# EAGLE design CAMCTRL_USB_328_3DR_CNCT_4LAY_V6 (EAGLE 6.5.0)
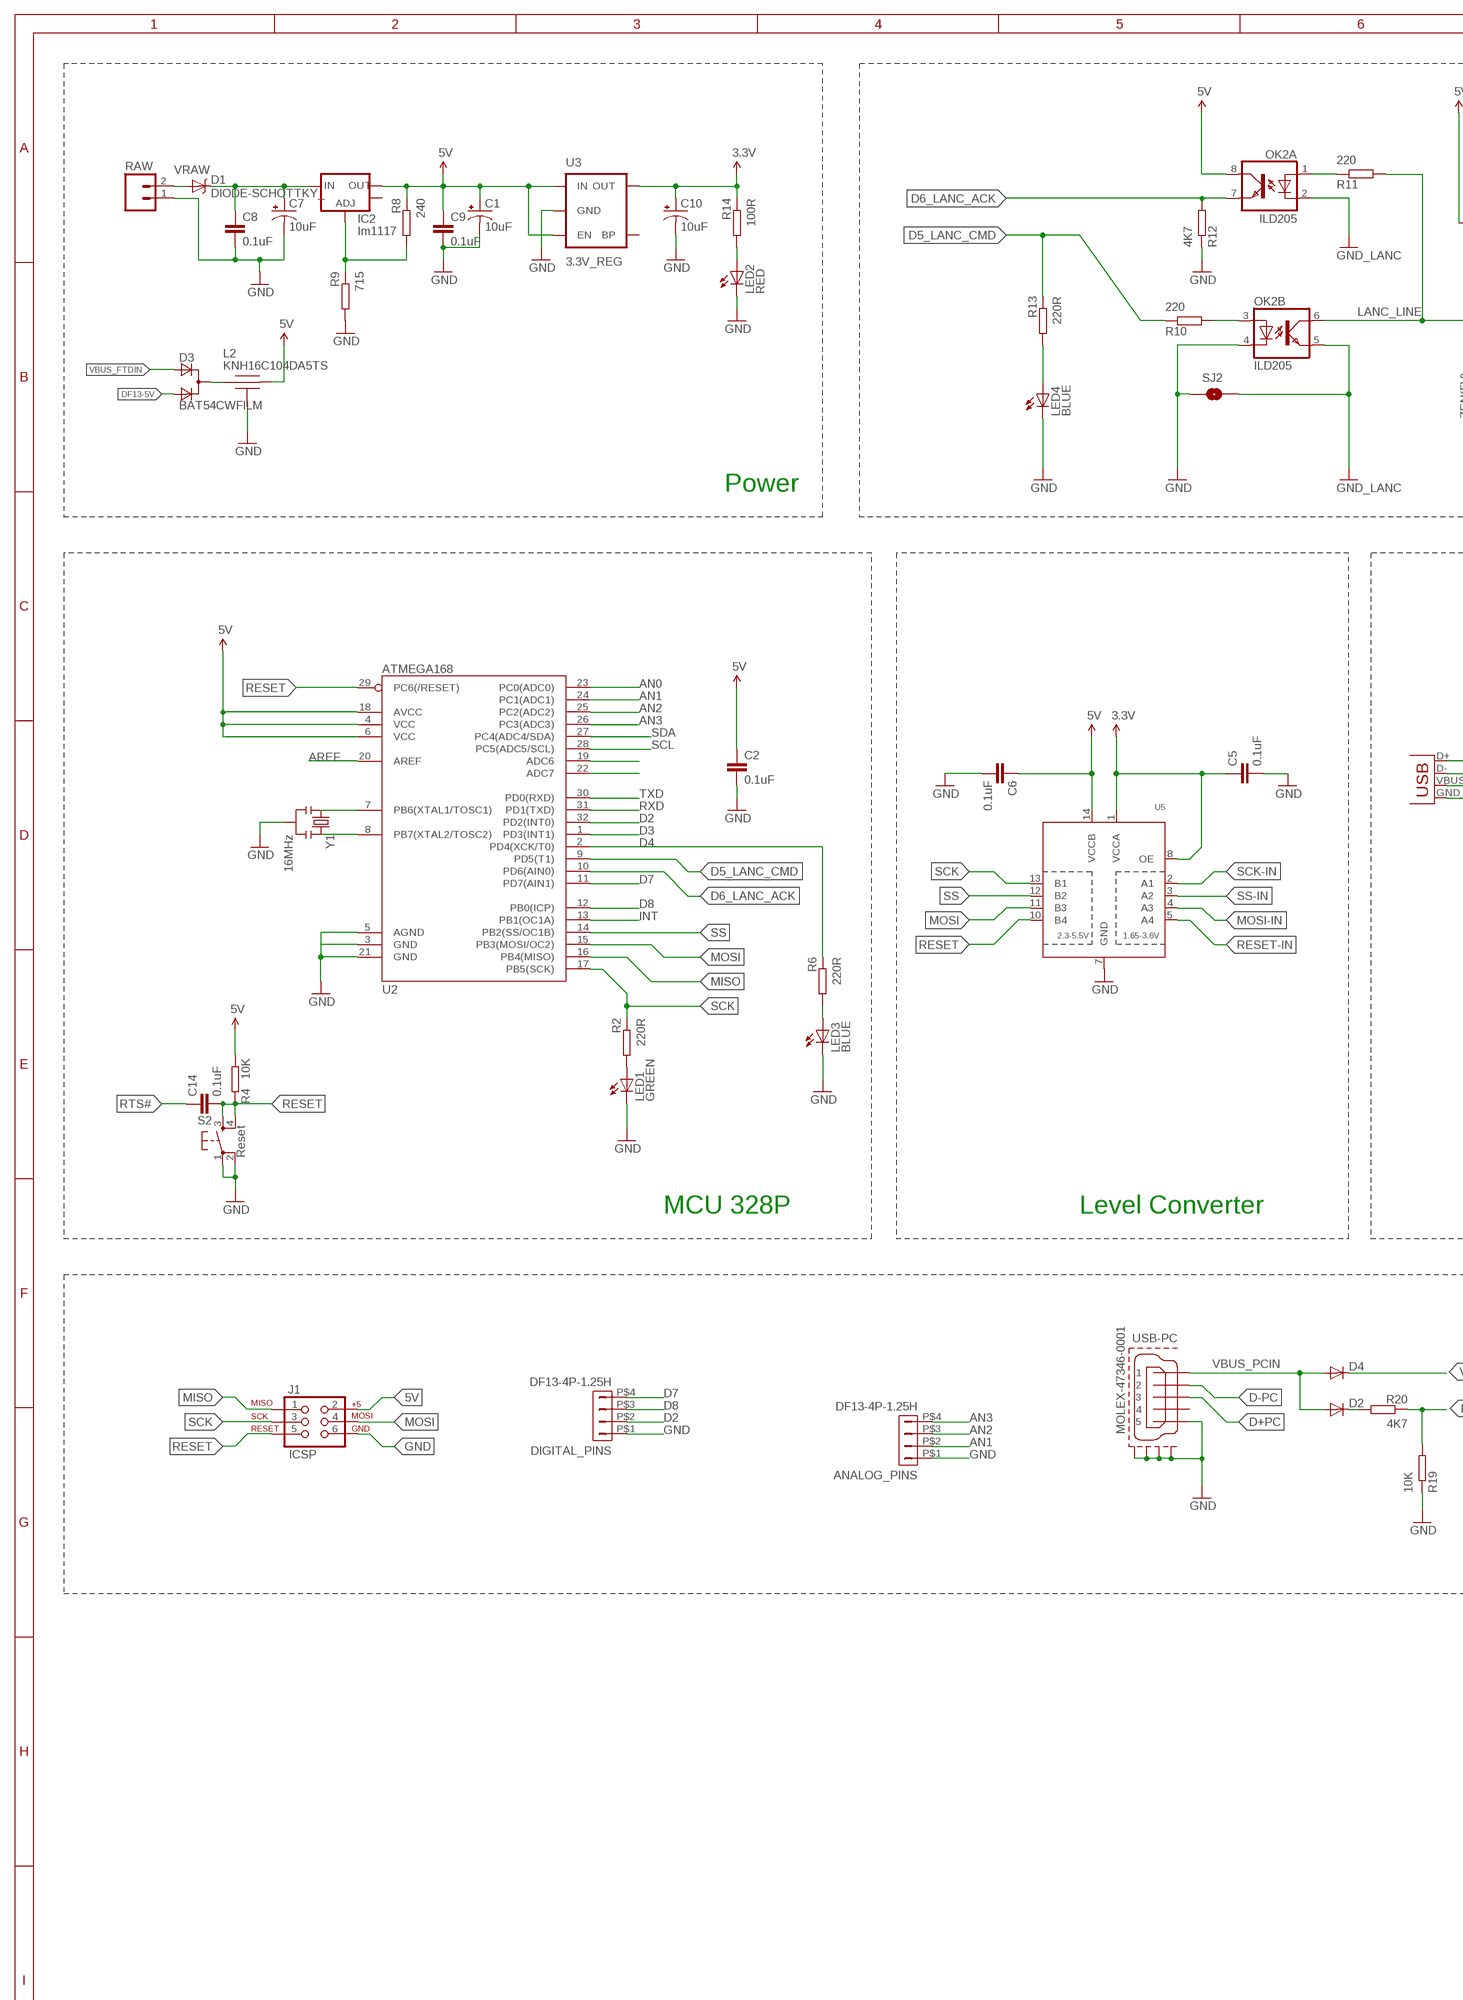
[diagram p0: schematic, sheet 1, part 1 of 2]
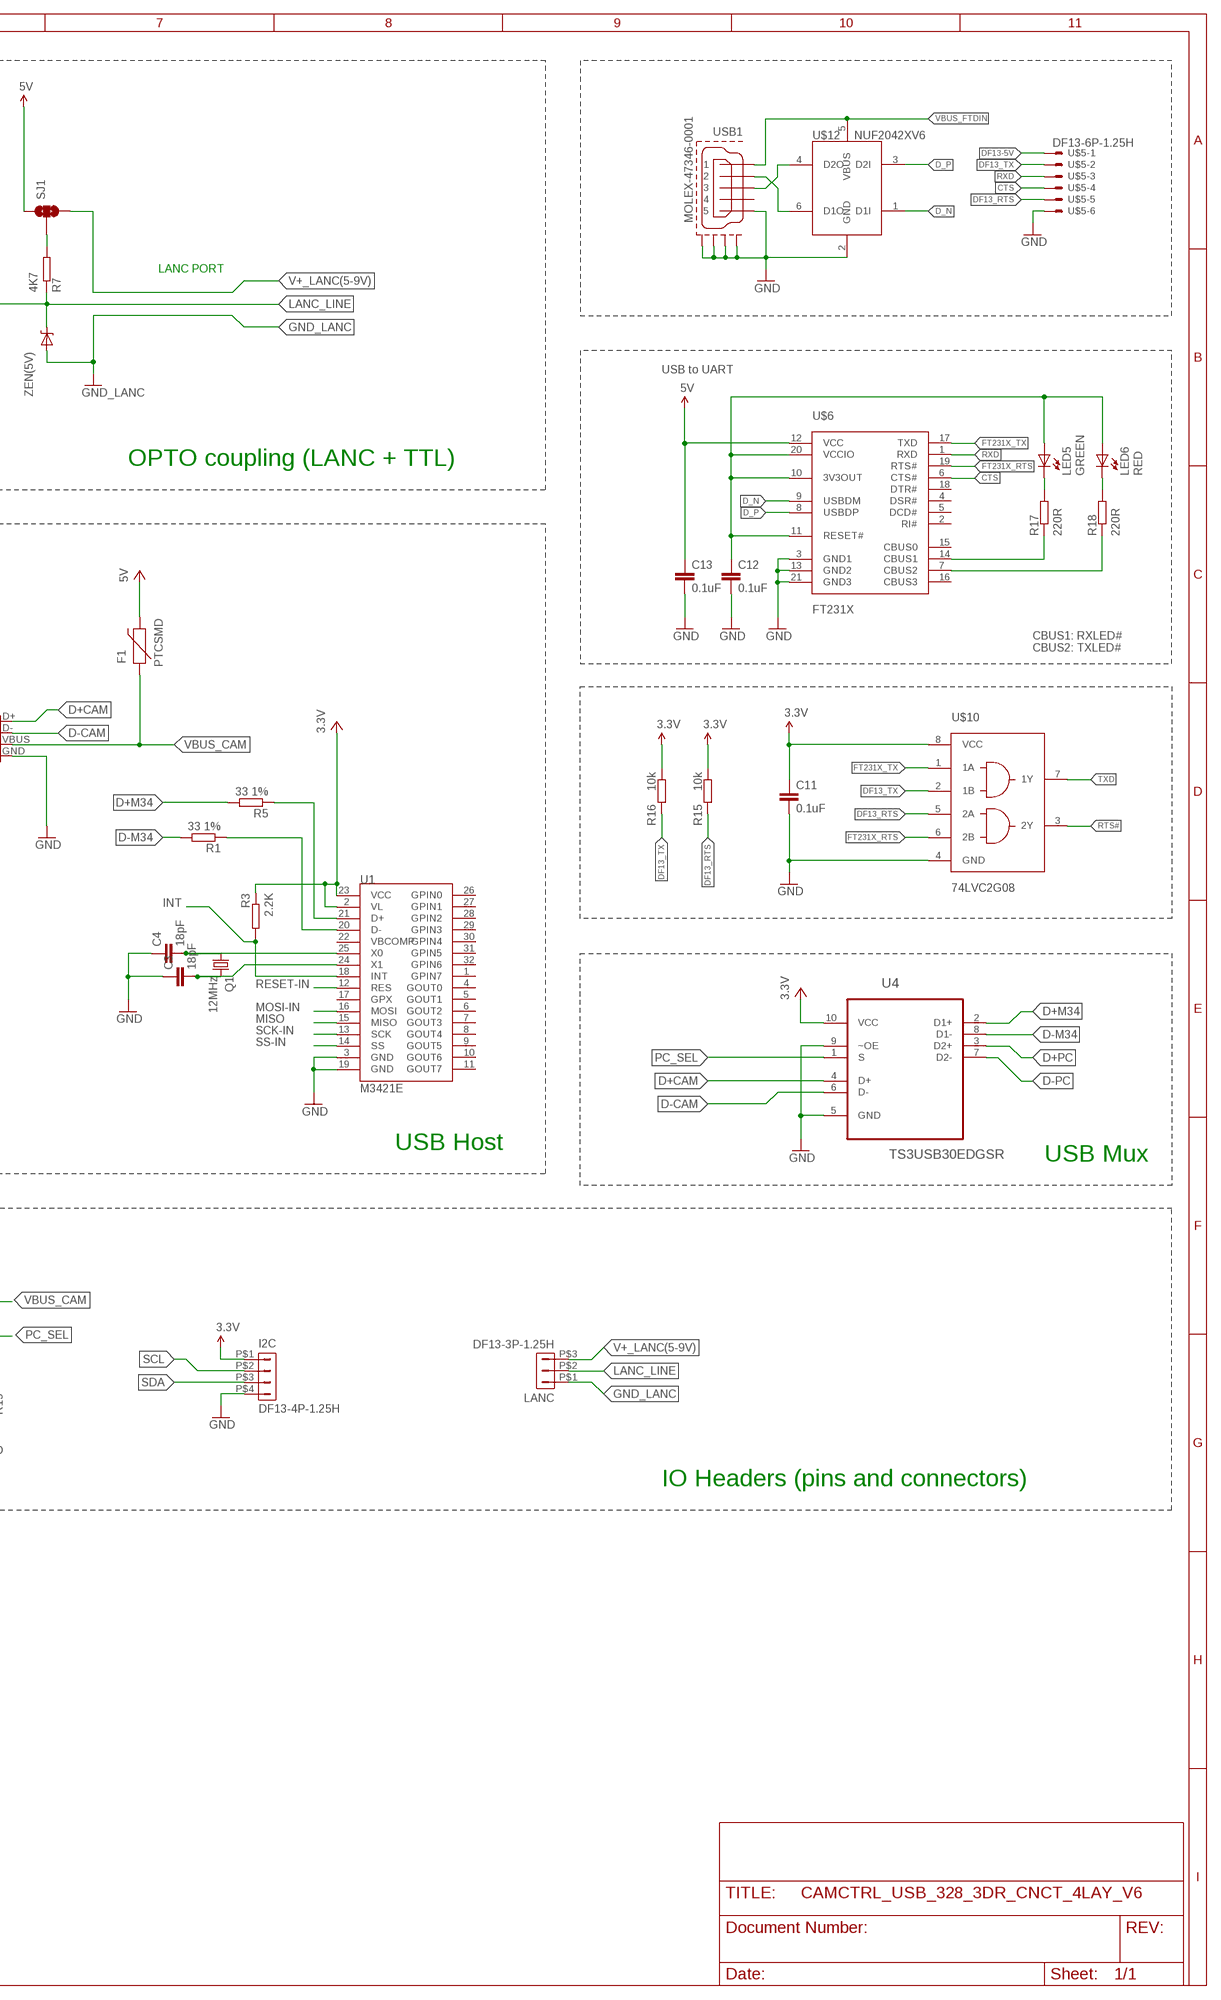
[diagram p1: schematic, sheet 1, part 2 of 2]

## Parts
ANALOG_PINS  DF13-4P-1.25H  [DF13A-4P-1.25H]
C1  10uF  CAP_POL1206  [EIA3216]
C2  0.1uF  CAPACITOR-0402  [0402-CAP]
C3  18pF  CAPACITOR-0402  [0402-CAP]
C4  18pF  CAPACITOR-0402  [0402-CAP]
C5  0.1uF  CAPACITOR-0402  [0402-CAP]
C6  0.1uF  CAPACITOR-0402  [0402-CAP]
C7  10uF  CAP_POL1206  [EIA3216]
C8  0.1uF  CAPACITOR-0402  [0402-CAP]
C9  0.1uF  CAPACITOR-0402  [0402-CAP]
C10  10uF  CAP_POL1206  [EIA3216]
C11  0.1uF  CAPACITOR-0402  [0402-CAP]
C12  0.1uF  CAPACITOR-0402  [0402-CAP]
C13  0.1uF  CAPACITOR-0402  [0402-CAP]
C14  0.1uF  CAPACITOR-0402  [0402-CAP]
D1  DIODE-SCHOTTKY_  [SMA-DIODE]
D2  DIODE-0603  [0603-DIO]
D3  BAT54CWFILM  D_2ASOT323  [SOT323]
D4  DIODE-0603  [0603-DIO]
DIGITAL_PINS  DF13-4P-1.25H  [DF13A-4P-1.25H]
F1  PTCSMD  [PTC-1206]
I2C  DF13-4P-1.25H  [DF13A-4P-1.25H]
IC2  lm1117  V_REG_LM1117SOT223  [SOT223]
J1  ICSP  AVR_SPI_PRG_6PTH  [2X3]
L2  KNH16C104DA5TS  [KYOCERA-KNH16-DA]
LANC  DF13-3P-1.25H  [DF13A-3P-1.25H]
LED1  GREEN  LED-0603  [0603-LED]
LED2  RED  LED-0603  [0603-LED]
LED3  BLUE  LED-0603  [0603-LED]
LED4  BLUE  LED-0603  [0603-LED]
LED5  GREEN  LED-0603  [0603-LED]
LED6  RED  LED-0603  [0603-LED]
OK2  ILD205  [SOIC08]
Q1  12MHz  CRYSTAL5X3  [CRYSTAL-SMD-5X3]
R1  33 1%  RESISTOR-0402  [0402-RES]
R2  220R  RESISTOR-0402  [0402-RES]
R3  2.2K  RESISTOR-0402  [0402-RES]
R4  10K  RESISTOR-0402  [0402-RES]
R5  33 1%  RESISTOR-0402  [0402-RES]
R6  220R  RESISTOR-0402  [0402-RES]
R7  4K7  RESISTOR-0402  [0402-RES]
R8  240  RESISTOR-0402  [0402-RES]
R9  715  RESISTOR-0402  [0402-RES]
R10  220  RESISTOR-0402  [0402-RES]
R11  220  RESISTOR-0402  [0402-RES]
R12  4K7  RESISTOR-0402  [0402-RES]
R13  220R  RESISTOR-0402  [0402-RES]
R14  100R  RESISTOR-0402  [0402-RES]
R15  10k  RESISTOR-0402  [0402-RES]
R16  10k  RESISTOR-0402  [0402-RES]
R17  220R  RESISTOR-0402  [0402-RES]
R18  220R  RESISTOR-0402  [0402-RES]
R19  10K  RESISTOR-0402  [0402-RES]
R20  4K7  RESISTOR-0402  [0402-RES]
RAW  M02PTH  [1X02]
S2  Reset  TAC_SWITCHSND  [TACTILE_SWITCH_SMD]
SJ1  SOLDERJUMPER_2WAYPASTE2&3  [SJ_3_PASTE2&3]
SJ2  SOLDERJUMPER-OLDNO  [SJ_2S-NO]
U1  M3421E  MAX3421ESMD  [TQFP32-5MM]
U2  ATMEGA168  [TQFP32-08]
U3  3.3V_REG  V_REG_LDOSMD  [SOT23-5]
U4  TS3USB30EDGSR  [SOP50P490X110-10N]
U5  TXS0104PWR  [TSSOP14]
U$5  DF13-6P-1.25H  [DF13A-6P-1.25H]
U$6  FT231X  [QFN20]
U$10  74LVC2G08  [VFSOP-8]
U$12  NUF2042XV6  [SOT563-6]
USB1  MOLEX-47346-0001  [MOLEX-47346-0001]
USB-PC  MOLEX-47346-0001  [MOLEX-47346-0001]
USB_HOST  USB-A-SMD  [USB-A-S-NOSILK-FEMALE]
Y1  16MHz  RESONATOR16MHZ  [RESONATOR-SMD]
ZEN(5V)  (5V)  DIODE-ZENER-0603  [0603-DIO]

## Nets
3.3V: C5.P$1 C10.A(+) C11.P$1 I2C.P$1 R3.P$1 R14.P$1 R15.P$1 R16.P$1 U1.2(VL) U1.23(VCC) U3.5(OUT) U4.10(VCC) U5.1(VCCA) U5.8(OE) U$10.8(VCC)
5V: C1.A(+) C2.P$1 C6.P$1 C9.P$1 C13.P$1 F1.2 IC2.2(OUT) J1.2 L2.P$2 OK2.8(A:COL) R4.P$2 R8.P$1 SJ1.1 U2.4(VCC) U2.6(VCC) U2.18(AVCC) U3.1(IN) U3.3(EN) U5.14(VCCB) U$6.12(VCC)
AN0: U2.23(PC0(ADC0))
AN1: ANALOG_PINS.P$2 U2.24(PC1(ADC1))
AN2: ANALOG_PINS.P$3 U2.25(PC2(ADC2))
AN3: ANALOG_PINS.P$4 U2.26(PC3(ADC3))
AREF: U2.20(AREF)
CTS: U$5.4 U$6.6(CTS#)
D2: DIGITAL_PINS.P$2 U2.32(PD2(INT0))
D3: U2.1(PD3(INT1))
D4: R6.P$1 U2.2(PD4(XCK/T0))
D5_LANC_CMD: R10.P$1 R13.P$1 U2.9(PD5(T1))
D6_LANC_ACK: OK2.7(A:EMIT) R12.P$2 U2.10(PD6(AIN0))
D7: DIGITAL_PINS.P$4 U2.11(PD7(AIN1))
D8: DIGITAL_PINS.P$3 U2.12(PB0(ICP))
D+CAM: U4.4(D+) USB_HOST.D+
D+M34: R5.P$2 U4.2(D1+)
D+PC: U4.3(D2+) USB-PC.D+
D-CAM: U4.6(D-) USB_HOST.D-
D-M34: R1.P$2 U4.8(D1-)
D-PC: U4.7(D2-) USB-PC.D-
D_N: U$6.9(USBDM) U$12.1(D1I)
D_P: U$6.8(USBDP) U$12.3(D2I)
DF13-5V: D3.3(A2) U$5.1
DF13_RTS: R15.P$2 U$5.5 U$10.5(2A)
DF13_TX: R16.P$2 U$5.2 U$10.2(1B)
FT231X_RTS: U$6.19(RTS#) U$10.6(2B)
FT231X_TX: U$6.17(TXD) U$10.1(1A)
GND: ANALOG_PINS.P$1 C1.C(-) C2.P$2 C3.P$1 C4.P$1 C5.P$2 C6.P$2 C7.C(-) C8.P$2 C9.P$2 C10.C(-) C11.P$2 C12.P$2 C13.P$2 DIGITAL_PINS.P$1 I2C.P$4 J1.6 L2.P$3 L2.P$4 L2.P$5 LED1.C LED2.C LED3.C LED4.C OK2.4(B:C) R9.P$2 R12.P$1 R19.P$1 RAW.1 S2.1 S2.2 SJ2.1 U1.3(GND) U1.19(GND) U2.3(GND) U2.5(AGND) U2.21(GND) U3.2(GND) U4.5(GND) U4.9(~OE) U5.7(GND) U$5.6 U$6.3(GND1) U$6.13(GND2) U$6.21(GND3) U$10.4(GND) U$12.2(GND) USB1.GND USB1.GND1 USB1.GND2 USB1.GND3 USB1.GND4 USB-PC.GND USB-PC.GND1 USB-PC.GND2 USB-PC.GND3 USB-PC.GND4 USB_HOST.GND Y1.2
GND_LANC: LANC.P$1 OK2.2(A:C) OK2.5(B:EMIT) SJ2.2 ZEN(5V).A ; supply symbol labelled GND
INT: R3.P$2 U1.18(INT) U2.13(PB1(OC1A))
LANC_LINE: LANC.P$2 OK2.6(B:COL) R7.P$1 R11.P$2 ZEN(5V).C
MISO: J1.1 U1.15(MISO) U2.16(PB4(MISO))
MOSI: J1.4 U2.15(PB3(MOSI/OC2)) U5.11(B3)
MOSI-IN: U1.16(MOSI) U5.4(A3)
N$1: OK2.3(B:A) R10.P$2
N$2: U2.7(PB6(XTAL1/TOSC1)) Y1.1
N$3: U2.8(PB7(XTAL2/TOSC2)) Y1.3
N$4: LED1.A R2.P$2
N$5: C4.P$2 Q1.1 U1.25(X0)
N$6: R5.P$1 U1.21(D+)
N$7: R1.P$1 U1.20(D-)
N$8: C3.P$2 Q1.3 U1.24(X1)
N$9: IC2.1(ADJ) R8.P$2 R9.P$1
N$10: OK2.1(A:A) R11.P$1
N$12: LED3.A R6.P$2
N$13: R7.P$2 SJ1.2
N$14: D3.1(C) L2.P$1
N$15: LED4.A R13.P$2
N$16: U2.19(ADC6)
N$17: U2.22(ADC7)
N$19: U$12.6(D1O) USB1.D-
N$20: U$12.4(D2O) USB1.D+
N$21: C12.P$1 LED5.A LED6.A U$6.10(3V3OUT) U$6.11(RESET#) U$6.20(VCCIO)
N$22: R17.P$1 U$6.14(CBUS1)
N$23: R18.P$1 U$6.7(CBUS2)
N$24: LED5.C R17.P$2
N$25: LED2.A R14.P$2
N$26: LED6.C R18.P$2
N$27: D1.A RAW.2
N$28: D2.C R20.P$2
PC_SEL: R19.P$2 R20.P$1 U4.1(S)
RESET: C14.P$2 J1.5 R4.P$1 S2.3 S2.4 U2.29(PC6(/RESET)) U5.10(B4)
RESET-IN: U1.12(RES) U5.5(A4)
RTS#: C14.P$1 U$10.3(2Y)
RXD: U2.31(PD1(TXD)) U$5.3 U$6.1(RXD)
SCK: J1.3 R2.P$1 U2.17(PB5(SCK)) U5.13(B1)
SCK-IN: U1.13(SCK) U5.2(A1)
SCL: I2C.P$2 U2.28(PC5(ADC5/SCL))
SDA: I2C.P$3 U2.27(PC4(ADC4/SDA))
SS: U2.14(PB2(SS/OC1B)) U5.12(B2)
SS-IN: U1.14(SS) U5.3(A2)
TXD: U2.30(PD0(RXD)) U$10.7(1Y)
V+_LANC(5-9V): LANC.P$3 SJ1.3
VBUS_CAM: D4.C F1.1 USB_HOST.VBUS
VBUS_FTDIN: D3.2(A1) U$12.5(VBUS) USB1.VBUS
VBUS_PCIN: D2.A D4.A USB-PC.VBUS
VRAW: C7.A(+) C8.P$1 D1.C IC2.3(IN)
Unconnected: IC2.4(OUT) U1.1(GPIN7) U1.4(GOUT0) U1.5(GOUT1) U1.6(GOUT2) U1.7(GOUT3) U1.8(GOUT4) U1.9(GOUT5) U1.10(GOUT6) U1.11(GOUT7) U1.17(GPX) U1.22(VBCOMP) U1.26(GPIN0) U1.27(GPIN1) U1.28(GPIN2) U1.29(GPIN3) U1.30(GPIN4) U1.31(GPIN5) U1.32(GPIN6) U3.4(BP) U$6.2(RI#) U$6.4(DSR#) U$6.5(DCD#) U$6.15(CBUS0) U$6.16(CBUS3) U$6.18(DTR#) USB1.ID USB-PC.ID

## Notes on the sheet
- LANC PORT
- USB to UART
- Power | OPTO coupling (LANC + TTL)
- CBUS1: RXLED#
  CBUS2: TXLED#
- MCU 328P | Level Converter | USB Host
- USB Mux
- IO Headers (pins and connectors)

## Library data of the parts
ANALOG_PINS DIGITAL_PINS I2C = con-hirose-df13:DF13-4P-1.25: DF13-4P 1.25mm Pitch Miniature Crimping Connector.
C1 C7 C10 = SparkFun:CAP_POL: Capacitor Polarized These are standard SMD and PTH capacitors. Normally 10uF, 47uF, and 100uF in electrolytic and tantalum varieties. Always verify the external diameter of the through hole cap, it varies with capacity, voltage, and manufacturer. The EIA devices should be standard.
C2-C6 C8 C9 C11-C14 = pel_dipol_comp:CAPACITOR
D1 = SparkFun-DiscreteSemi:DIODE-SCHOTTKY: Commonly MBRA140.
D2 D4 = pel_dipol_comp:DIODE
D3 = zetex:D_2A: Dual DIODE; OC_FARNELL: unknown; OC_NEWARK: unknown
F1 = SparkFun:PTC: Resettable Fuse PTC Resettable Fuse. Spark Fun Electronics SKU : COM-08357
IC2 = SparkFun:V_REG_LM1117: Voltage Regulator LM1117 Standard adjustable voltage regulator but in SMD form. Spark Fun Electronics SKU : COM-00595
J1 = SparkFun-Connectors:AVR_SPI_PRG_6: AVR ISP 6 Pin This is the reduced ISP connector for AVR programming. Common on Arduino. This footprint will take up less PCB space and can be used with a 10-pin to 6-pin adapter such as SKU: BOB-08508
L2 = pixhawk2:KNH16C104DA5TS: Kyocera KNH16C104DA5TS EMI filter
LANC = con-hirose-df13:DF13-3P-1.25: DF13-3P 1.25mm Pitch Miniature Crimping Connector.
LED1-LED6 = pel_dipol_comp:LED
OK2 = optocoupler:ILD2*: Siemens ILD205/206/207/211/213/217 DUAL PHOTOTRANSISTOR SMALL OUTLINE SURFACE MOUNT OPTOCOUPLER Source: 153385-da-01-en-Optocoupler_ILD205-T.pdf; MF: VISHAY/TELEFUNKEN; MPN: ILD205T; OC_FARNELL: 1469512; OC_NEWARK: 20H8678
Q1 = SparkFun-FreqCtrl:CRYSTAL: Various standard crystals. Proven footprints. Spark Fun Electronics SKU : COM-00534
R1-R20 = pel_dipol_comp:RESISTOR
RAW = SparkFun-Connectors:M02: Header 2 Standard 2-pin 0.1" header. Use with straight break away headers (SKU : PRT-00116), right angle break away headers (PRT-00553), swiss pins (PRT-00743), machine pins (PRT-00117), and female headers (PRT-00115). Molex polarized connector foot print use with SKU : PRT-08233 with associated crimp pins and housings.
S2 = SparkFun:TAC_SWITCH: Momentary Switch Button commonly used for reset or general input. Spark Fun Electronics SKU : COM-00097
SJ1 = SparkFun-Passives:SOLDERJUMPER_2WAY: Solder Jumper 2 way solder jumper
SJ2 = SparkFun-Passives:SOLDERJUMPER-OLD: Solder Jumper Standard SMD solder jumper. Used to automate production. Two varients : Normally Open and Normally Closed are the same, but have different paste layers. NC will have a large amount of paste and should jumper during reflow.
U1 = SparkFun-DigitalIC:MAX3421E: USB Peripheral/Host Controller w/ SPI
U2 = SparkFun-DigitalIC:ATMEGA168: Atmel 32-pin 8-bit micro, 16k flash.
U3 = SparkFun:V_REG_LDO: Voltage Regulator LDO Standard 150mA LDO voltage regulator in SOT-23 layout. Micrel part MIC5205. BP (by-pass) pin is used to lower output noise with 470pF cap.
U4 = Texas Instruments_By_element14_Batch_1:TS3USB30EDGSR: 1:2 MULTIPLEXER/DEMULTIPLEXER; MPN: TS3USB30EDGSR; OC_FARNELL: -; OC_NEWARK: 64R0806; PACKAGE: MSOP-10; SUPPLIER: Texas Instruments
U5 = adafruit:TXS0104PWR: 4-Bit Bi-Directional Level Shifter 1.65V-3.6V (VCCA) to 2.3V-5.5V (VCCB) bi-directional level shifter with auto direction sensing. Max data rate - VCCA 2.5V: 24Mbps (41ns), VCCA 3.3V: 24Mbps (41ns) Digikey: 296-20697-2-ND
U$5 = pixhawk2:DF13-6P-1.25?
U$6 = 3DRobotics:FT231X: FT231X – Full Speed USB to Full Handshake UART This USB2.0 Full Speed IC offers a compact bridge to full handshake UART interfaces. The device is a UART, capable of operating up to 3MBaud, with low power consumption (8mA). The FT231X includes the complete FT-X series feature set and enables USB to be added into a system design quickly and easily over a UART interface; DATASHEET: http://www.ftdichip.com/Support/Documents/DataSheets/ICs/DS_FT231X.pdf; LINK: http://www.ftdichip.com/Products/ICs/FT231X.html; MFGPN: FT231X
U$10 = 3DRobotics:74LVC2G08: 74LVC2G08 dual 2-input AND gate Inputs can be driven from either 3.3 V or 5 V devices. This feature allows the use of the 74LVC2G08 as a translator in a mixed 3.3 V and 5 V environment. This device is fully specified for partial power-down applications using IOFF. The IOFF circuitry disables the output, preventing a damaging backflow current through the device when it is powered down.; DATASHEET: http://www.nxp.com/documents/data_sheet/74LVC2G08.pdf; LINK: http://www.nxp.com/products/logic/gates/and_gates/74LVC2G08DC.html; MFGPN: 74LVC2G08
U$12 = pixhawk2:NUF2042XV6
USB1 USB-PC = pixhawk2:MOLEX-47346-0001: MICRO USB B, BOTTOM MOUNT
USB_HOST = SparkFun-Connectors:USB: USB Connectors USB-B-PTH is fully proven SKU : PRT-00139/CONN-08278 USB-miniB is fully proven SKU : PRT-00587 USB-A-PCB is untested. USB-A-H is throughly reviewed, but untested. Spark Fun Electronics SKU : PRT-00437 USB-B-SMT is throughly reviewed, but untested. Needs silkscreen touching up. USB-A-S has not been used/tested USB-MB-H has not been used/tested USB-MICROB has been used. CONN-09505; PROD_ID: CONN-09520
Y1 = SparkFun-FreqCtrl:RESONATOR: Resonator Small SMD resonator. Used, eg, on the Arduino Pro/ Pro Mini boards. 8MHz- XTAL-08895 16MHz- XTAL-08900; PROD_ID: XTAL-08900
ZEN(5V) = pel_dipol_comp:DIODE-ZENER

## Net classes
0 default: width 0.152 mm

## Board
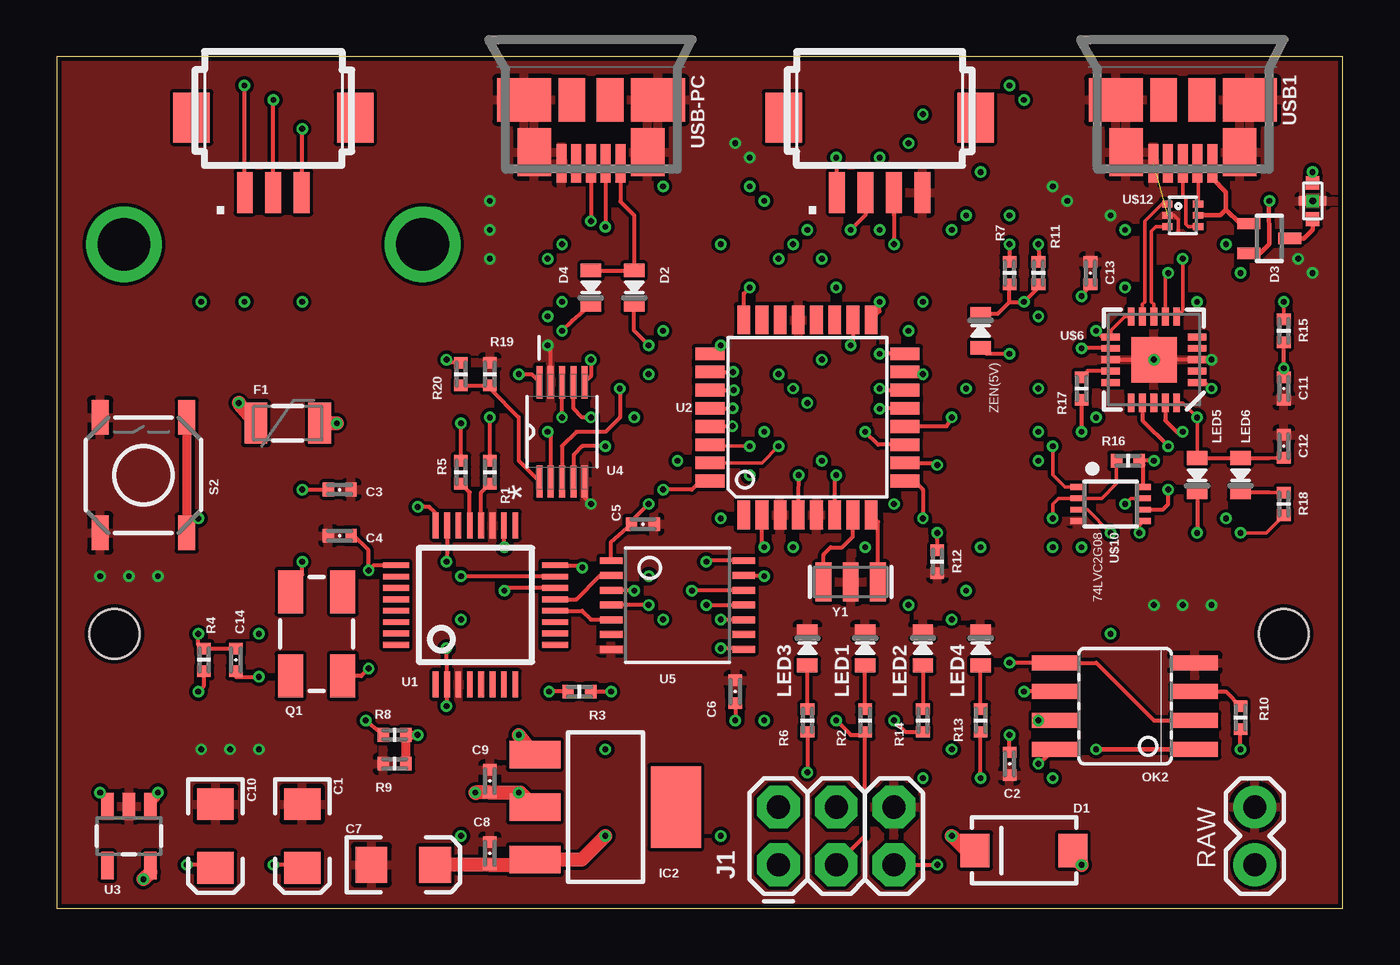
[diagram p2: board, top side]
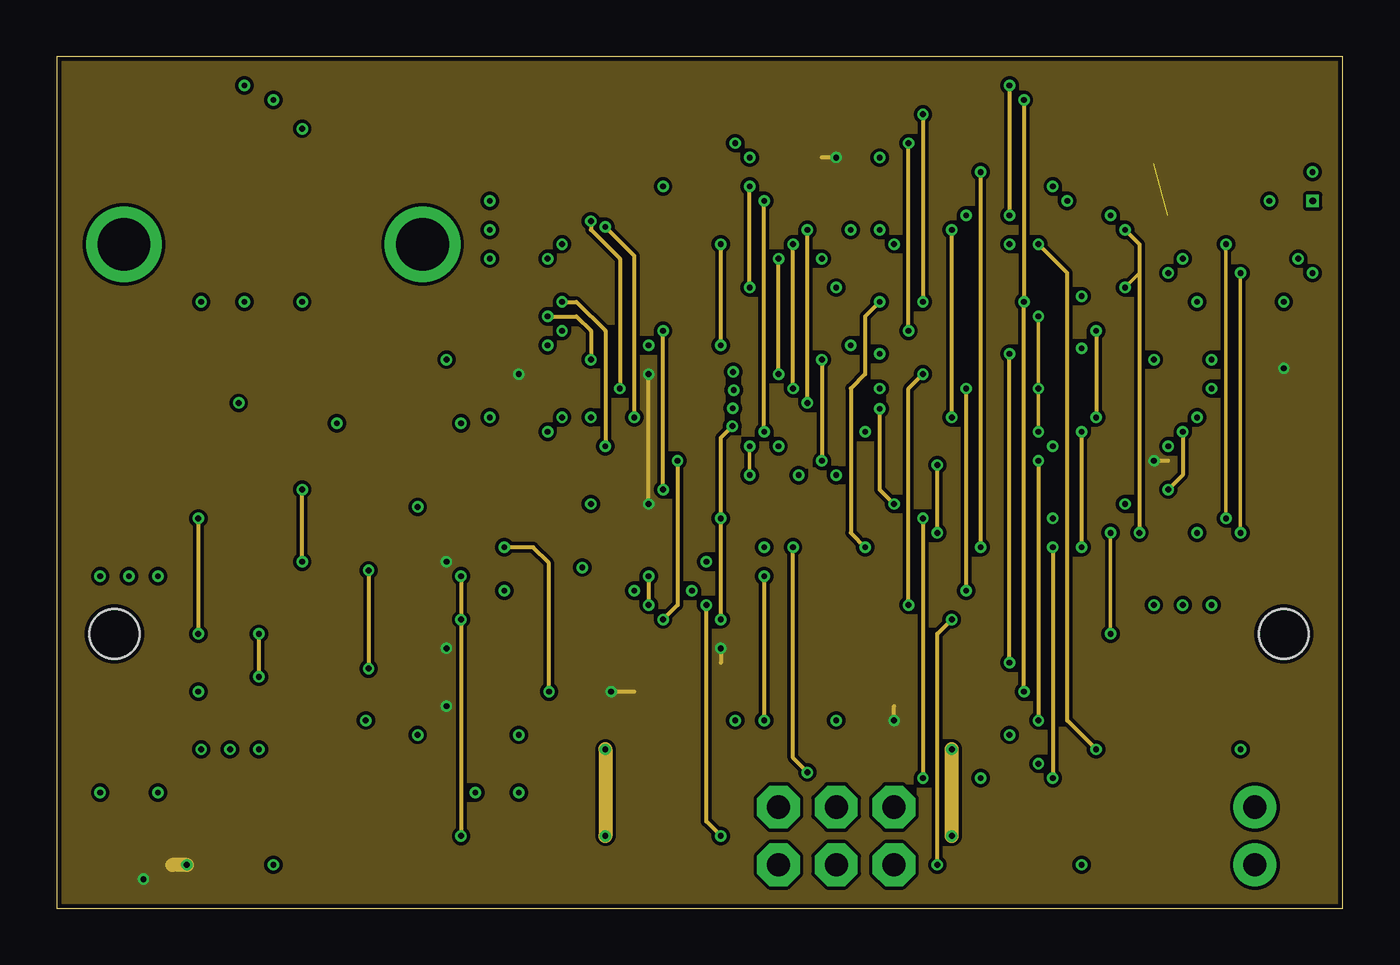
[diagram p3: board, inner layer Route2]
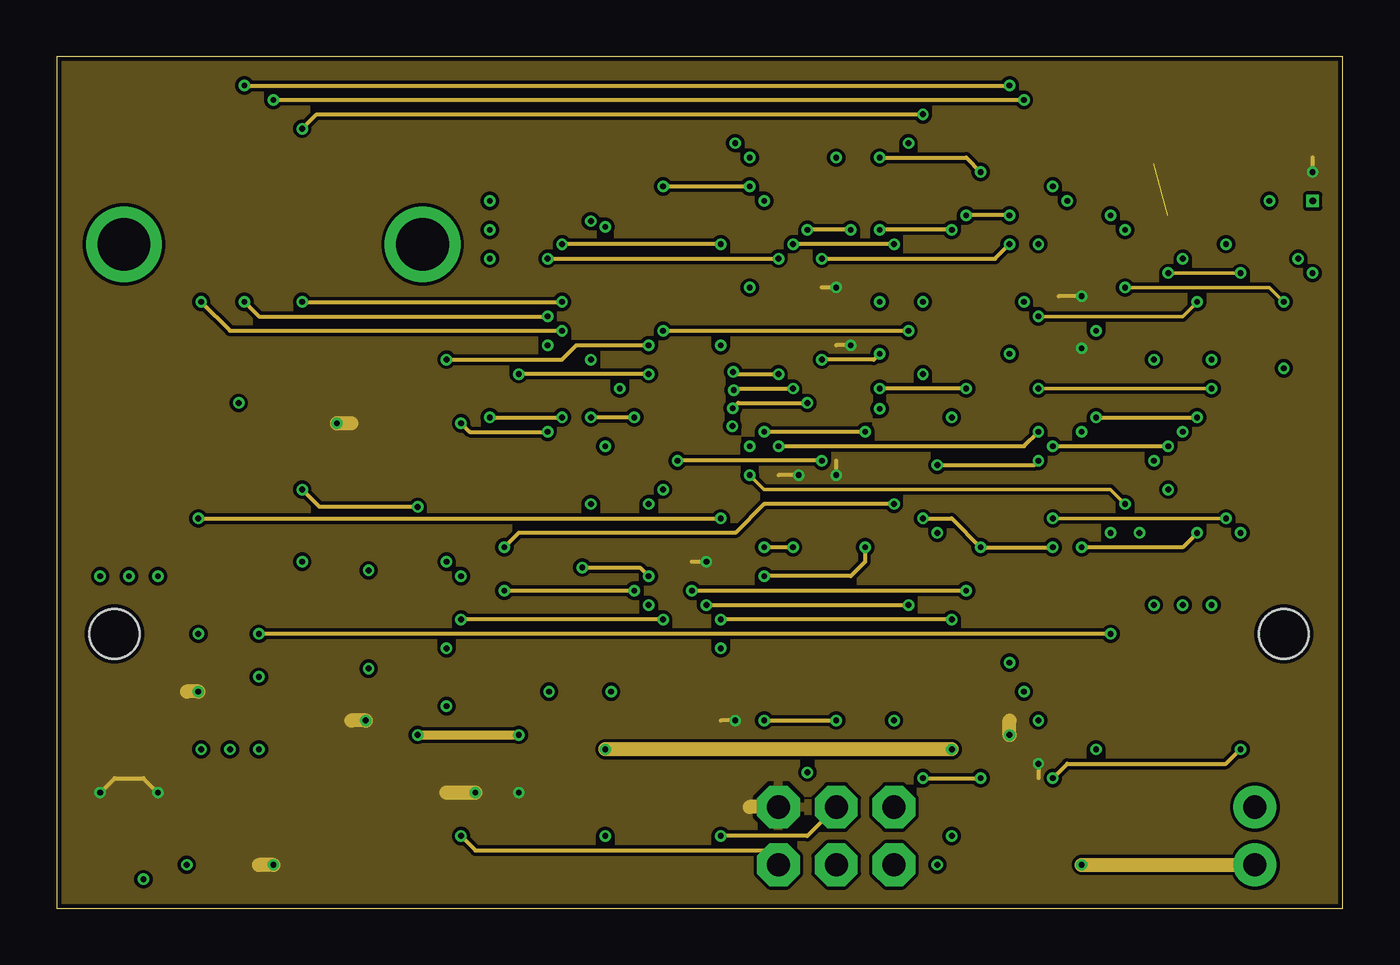
[diagram p4: board, inner layer Route15]
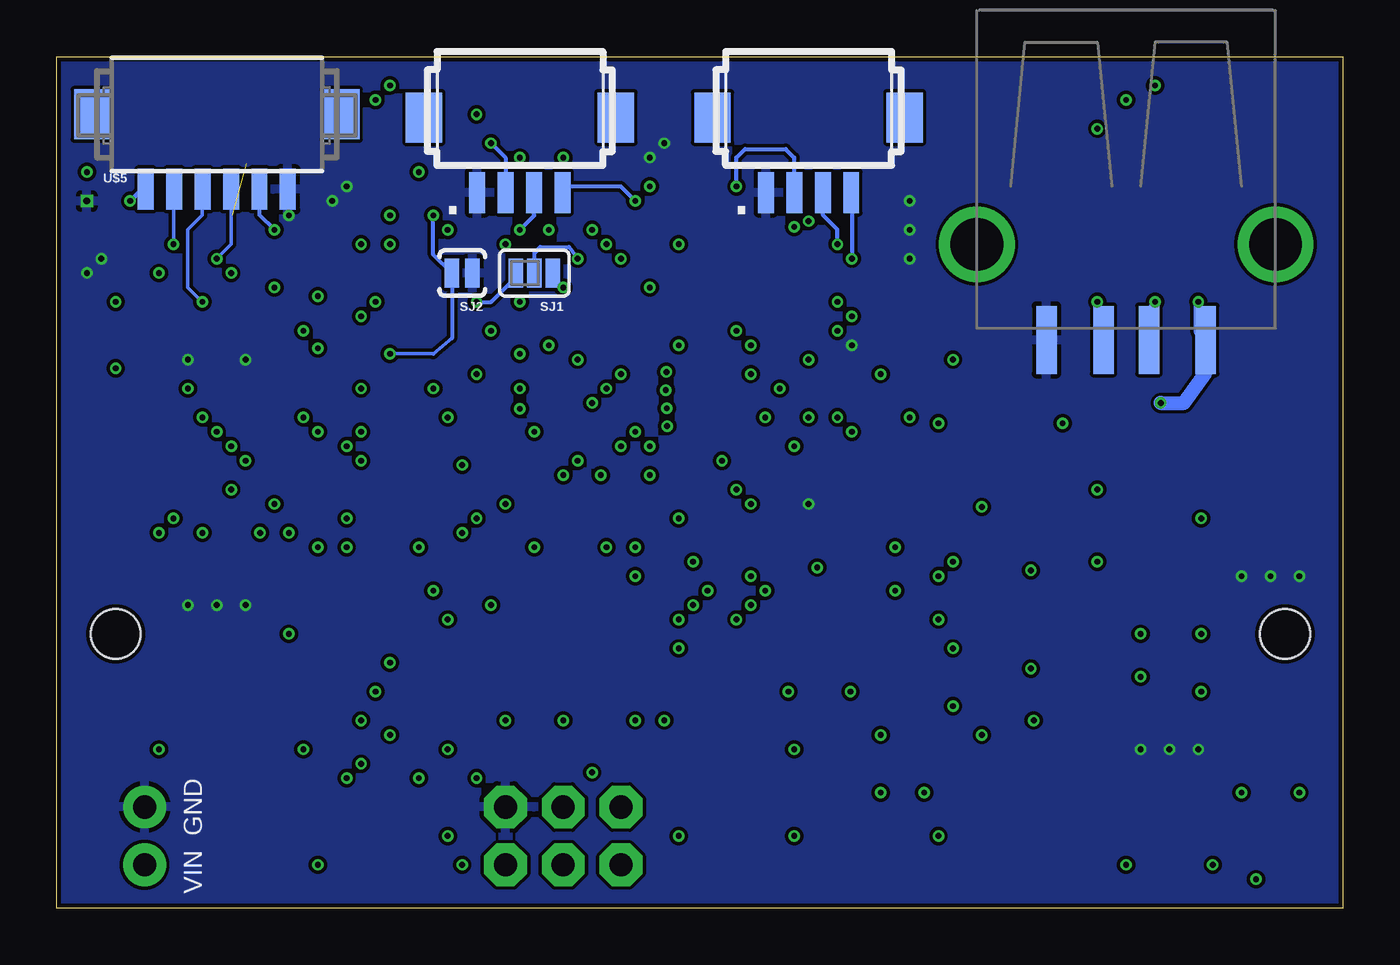
[diagram p5: board, bottom side, seen from below]

Size 56.57 x 37.45 mm. Coordinates in mm from the lower left corner, seen from the top.
Outline: 0,0 56.57,0 56.57,37.45 0,37.45 0,0
Copper layers (1*2*15*16): Top 0.05mm / dielectric 0.55mm / Route2 0.02mm / dielectric 0.42mm / Route15 0.02mm / dielectric 0.55mm / Bottom 0.05mm
Design rules "Sandro *": minimum track width 6mil, minimum drill 10mil, track to track 0.15mm, track to pad 0.15mm, pad to pad 0.15mm, via to via 0.15mm, smd to smd 0.15mm, copper to edge 8mil, drill to drill 0.2mm, minimum pad ring 0.125mm, minimum via ring 0.125mm, stop-mask expansion 1mil, vias tented up to drill 0.31mm, thermal gap 8mil
Holes 2.2 mm at 2.54,12.06 53.98,12.06

### Footprints (pad centres in the part's own frame; a part is rotated, then mirrored left to right if it is on the bottom)
DF13A-4P-1.25H = smd 1.6 x 2.2: M$0 -4.225,2.4; M$1 4.225,2.4 | smd 0.7 x 1.8: P$1 -1.875,-0.9; P$2 -0.625,-0.9; P$3 0.625,-0.9; P$4 1.875,-0.9
EIA3216 = smd 1.4 x 1.6: A 1.4,0; C -1.4,0
0402-CAP = smd 0.5 x 0.6: P$1 -0.5,0; P$2 0.5,0
SMA-DIODE = smd 1.27 x 1.47: A -2.15,0; C 2.15,0
0603-DIO = smd 0.6 x 0.9: A 0.75,0; C -0.75,0
SOT323 = smd 0.5 x 1: 1 0,0.9; 2 -0.65,-0.9; 3 0.65,-0.9
PTC-1206 = smd 1 x 1.8: 1 -1.4,0; 2 1.4,0
SOT223 = smd 1.219 x 2.235: 1 -2.311,-3.099; 2 0,-3.099; 3 2.311,-3.099 | smd 3.6 x 2.2: 4 0,3.099
2X3 = drill 1.016 pad 1.88 octagon: 1 0,0; 2 0,2.54; 3 2.54,0; 4 2.54,2.54; 5 5.08,0; 6 5.08,2.54
KYOCERA-KNH16-DA = smd 0.6 x 0.6: P$1 -0.8,0; P$2 0.8,0 | smd 0.4 x 0.4: P$3 0,-0.4; P$4 0,0.4 | drill 0.3 pad 0.4 square: P$5 0,0
DF13A-3P-1.25H = smd 1.6 x 2.2: M$0 -3.6,2.4; M$1 3.6,2.4 | smd 0.7 x 1.8: P$1 -1.25,-0.9; P$2 0,-0.9; P$3 1.25,-0.9
0603-LED = smd 0.6 x 0.9: A 0.75,0; C -0.75,0
SOIC08 = smd 0.66 x 2.032: 1 -1.905,-3.073; 2 -0.635,-3.073; 3 0.635,-3.073; 4 1.905,-3.073; 5 1.905,3.073; 6 0.635,3.073; 7 -0.635,3.073; 8 -1.905,3.073
CRYSTAL-SMD-5X3 = smd 1.9 x 1.1: 1 -1.85,-1.15; 2 1.85,-1.15; 3 1.85,1.15; 4 -1.85,1.15
0402-RES = smd 0.5 x 0.6: P$1 -0.5,0; P$2 0.5,0
1X02 = drill 1.016 pad 1.88: 1 0,0; 2 2.54,0
TACTILE_SWITCH_SMD = smd 1.524 x 0.762: 1 -2.54,1.905; 2 2.54,1.905; 3 -2.54,-1.905; 4 2.54,-1.905
SJ_3_PASTE2&3 = smd 0.635 x 1.27: 1 -0.813,0; 2 0,0; 3 0.813,0
SJ_2S-NO = smd 0.635 x 1.27: 1 -0.45,0; 2 0.45,0
TQFP32-5MM = smd 1.143 x 0.254: 1 -3.5,1.75; 2 -3.5,1.25; 3 -3.5,0.75; 4 -3.5,0.25; 5 -3.5,-0.25; 6 -3.5,-0.75; 7 -3.5,-1.25; 8 -3.5,-1.75; 17 3.5,-1.75; 18 3.5,-1.25; 19 3.5,-0.75; 20 3.5,-0.25; 21 3.5,0.25; 22 3.5,0.75; 23 3.5,1.25; 24 3.5,1.75 | smd 0.254 x 1.143: 9 -1.75,-3.5; 10 -1.25,-3.5; 11 -0.75,-3.5; 12 -0.25,-3.5; 13 0.25,-3.5; 14 0.75,-3.5; 15 1.25,-3.5; 16 1.75,-3.5; 25 1.75,3.5; 26 1.25,3.5; 27 0.75,3.5; 28 0.25,3.5; 29 -0.25,3.5; 30 -0.75,3.5; 31 -1.25,3.5; 32 -1.75,3.5
TQFP32-08 = smd 1.27 x 0.559: 1 -4.293,2.8; 2 -4.293,2; 3 -4.293,1.2; 4 -4.293,0.4; 5 -4.293,-0.4; 6 -4.293,-1.2; 7 -4.293,-2; 8 -4.293,-2.8; 17 4.293,-2.8; 18 4.293,-2; 19 4.293,-1.2; 20 4.293,-0.4; 21 4.293,0.4; 22 4.293,1.2; 23 4.293,2; 24 4.293,2.8 | smd 0.559 x 1.27: 9 -2.8,-4.293; 10 -2,-4.293; 11 -1.2,-4.293; 12 -0.4,-4.293; 13 0.4,-4.293; 14 1.2,-4.293; 15 2,-4.293; 16 2.8,-4.293; 25 2.8,4.293; 26 2,4.293; 27 1.2,4.293; 28 0.4,4.293; 29 -0.4,4.293; 30 -1.2,4.293; 31 -2,4.293; 32 -2.8,4.293
SOT23-5 = smd 0.55 x 1.2: 1 -0.95,-1.3; 2 0,-1.3; 3 0.95,-1.3; 4 0.95,1.3; 5 -0.95,1.3
SOP50P490X110-10N = smd 1.422 x 0.279: 1 -2.184,0.991; 2 -2.184,0.508; 3 -2.184,0; 4 -2.184,-0.508; 5 -2.184,-0.991; 6 2.184,-0.991; 7 2.184,-0.508; 8 2.184,0; 9 2.184,0.508; 10 2.184,0.991
TSSOP14 = smd 0.305 x 0.991: 1 -1.95,-2.918; 2 -1.3,-2.918; 3 -0.65,-2.918; 4 0,-2.918; 5 0.65,-2.918; 6 1.3,-2.918; 7 1.95,-2.918; 8 1.95,2.918; 9 1.3,2.918; 10 0.65,2.918; 11 0,2.918; 12 -0.65,2.918; 13 -1.3,2.918; 14 -1.95,2.918
DF13A-6P-1.25H = smd 0.7 x 1.8: 1 -3.125,-3.3; 2 -1.875,-3.3; 3 -0.625,-3.3; 4 0.625,-3.3; 5 1.875,-3.3; 6 3.125,-3.3 | smd 1.6 x 2.2: S1 5.475,0; S2 -5.475,0
QFN20 = smd 0.8 x 0.3: 1 -1.9,1; 2 -1.9,0.5; 3 -1.9,0; 4 -1.9,-0.5; 5 -1.9,-1; 11 1.9,-1; 12 1.9,-0.5; 13 1.9,0; 14 1.9,0.5; 15 1.9,1 | smd 0.3 x 0.8: 6 -1,-1.9; 7 -0.5,-1.9; 8 0,-1.9; 9 0.5,-1.9; 10 1,-1.9; 16 1,1.9; 17 0.5,1.9; 18 0,1.9; 19 -0.5,1.9; 20 -1,1.9 | smd 2 x 2: 21 0,0
VFSOP-8 = smd 0.25 x 0.65: 1 -0.75,-1.45; 2 -0.25,-1.45; 3 0.25,-1.45; 4 0.75,-1.45; 5 0.75,1.45; 6 0.25,1.45; 7 -0.25,1.45; 8 -0.75,1.45
SOT563-6 = smd 0.3 x 0.45: 1 -0.5,-0.675; 2 0,-0.675; 3 0.5,-0.675; 4 0.5,0.675; 5 0,0.675; 6 -0.5,0.675
MOLEX-47346-0001 = smd 1.7 x 0.44: D+ 2.8,0; D- 2.8,0.65; GND 2.8,-1.3; ID 2.8,-0.65; VBUS 2.8,1.3 | smd 1.9 x 2.375: GND1 0,2.95; GND4 0,-2.95 | smd 2.1 x 1.475: GND2 2.3,2.5; GND3 2.3,-2.5 | smd 1.9 x 1.175: GND5 0,-0.838; GND6 0,0.838
USB-A-S-NOSILK-FEMALE = smd 3 x 0.9: D+ 4.212,-1; D- 4.212,1; GND 4.212,-3.5; VBUS 4.212,3.5 | drill 2.311: P$5 0,-6.566; P$6 0,6.566
RESONATOR-SMD = smd 0.7 x 1.7: 1 -1.2,0; 2 0,0; 3 1.2,0

### Placement (x,y rotation side)
ANALOG_PINS  23.5,32.38 0 bottom
C1  10.79,3.17 270 top
C2  41.91,6.35 270 top
C3  12.45,18.41 180 top
C4  12.45,16.38 0 top
C5  25.78,16.89 0 top
C6  29.84,9.53 90 top
C7  15.24,1.91 0 top
C8  19.05,2.41 90 top
C9  19.05,5.59 90 top
C10  6.99,3.17 270 top
C11  53.98,22.86 270 top
C12  53.98,20.32 90 top
C13  45.47,27.94 90 top
C14  7.87,10.92 90 top
D1  42.55,2.54 180 top
D2  25.4,27.3 90 top
D3  53.34,29.46 270 top
D4  23.5,27.3 90 top
DIGITAL_PINS  36.2,32.38 0 bottom
F1  10.16,21.34 0 top
I2C  36.2,32.38 0 top
IC2  24.13,4.45 270 top
J1  31.75,1.91 0 top
L2  55.24,31.11 90 top
LANC  9.53,32.38 0 top
LED1  35.56,11.43 270 top
LED2  38.1,11.43 270 top
LED3  33.02,11.43 270 top
LED4  40.64,11.43 270 top
LED5  50.16,19.05 90 top
LED6  52.07,19.05 90 top
OK2  46.99,8.89 90 top
Q1  11.43,12.06 90 top
R1  19.05,19.18 90 top
R2  35.56,8.26 90 top
R3  22.99,9.53 180 top
R4  6.48,10.92 270 top
R5  17.78,19.18 90 top
R6  33.02,8.26 90 top
R7  41.91,27.94 90 top
R8  14.86,7.62 0 top
R9  14.86,6.35 180 top
R10  52.07,8.38 90 top
R11  43.18,27.94 270 top
R12  38.73,15.24 90 top
R13  40.64,8.26 90 top
R14  38.1,8.26 90 top
R15  53.98,25.4 90 top
R16  47.12,19.68 180 top
R17  45.09,22.86 270 top
R18  53.98,17.78 90 top
R19  19.05,23.5 270 top
R20  17.78,23.5 90 top
RAW  52.7,4.45 270 top
S2  3.81,19.05 90 top
SJ1  35.56,27.94 180 bottom
SJ2  38.73,27.94 180 bottom
U1  18.41,13.34 90 top
U2  33.02,21.59 90 top
U3  3.17,3.17 180 top
U4  22.23,20.95 90 top
U5  27.3,13.34 270 top
U$5  49.53,34.92 0 bottom
U$6  48.26,24.13 180 top
U$10  46.35,17.78 270 top
U$12  49.53,30.48 270 top
USB1  49.53,35.56 270 top
USB-PC  23.5,35.56 270 top
USB_HOST  9.53,29.21 270 bottom
Y1  34.92,14.35 0 top
ZEN(5V)  40.64,25.4 270 top

### Tracks (layer width: path | path; a pad name or v marks a point on that pad's centre or on a via)
3.3V  (via drill 0.25, 0.25 pad 0.25)
  Top 0.178: U3.5 4.12,1.58 | C10.A 6.35,1.91 v5.71,1.91 | v17.14,11.43 17.16,10.14 U1.2 17.14,9.81 v17.14,8.89 | U1.23 17.16,15.89 v17.14,15.24 | R3.P$1 v24.38,9.53 | I2C.P$1 34.32,32.99 v34.29,33.02 | R16.P$1 47.62,19.69 | U$10.8 47.8,19.5 R16.P$1 | C11.P$1 53.97,23.36 v53.98,23.75 R15.P$1 | v36.83,8.26 37.33,7.75 R14.P$1 | v48.26,19.68 R16.P$1 | U5.1 24.39,16.12 C5.P$1 25.27,17.01 v26.04,17.78 | v20.32,23.5 20.88,23.5 U4.10 | U5.8 30.18,11.43 v29.21,11.43
  Top 0.61: 4.12,1.58 v3.81,1.27
  Route2 0.178: v24.38,9.53 25.4,9.53 | v36.83,8.26 36.83,8.89 | v34.29,33.02 33.66,33.02 | v48.26,19.68 48.9,19.68 | v26.04,17.78 v26.04,23.5 | v29.21,11.43 29.21,10.79
  Route2 0.61: v5.71,1.91 5.08,1.91
  Route15 0.178: v26.04,23.5 v20.32,23.5
  pour Route2: -2.54,40.01 59.05,40.01 59.05,-2.54 -2.54,-2.54
5V  (via drill 0.25)
  Top 0.178: C1.A 10.16,1.91 v9.53,1.91 | U3.3 2.23,4.76 v1.91,5.08 | v4.45,5.08 4.45,4.79 U3.1 | IC2.2 20.95,4.45 | 20.3,5.07 v20.32,5.08 | U2.4 32.62,18.05 v32.64,19.05 | U2.6 34.22,18.85 v34.29,19.05 | OK2.8 v43.18,6.35 | C2.P$1 v41.91,7.62 | C13.P$1 v45.09,26.92 | R8.P$1 v13.59,8.26 | L2.P$2 v55.24,32.38 | U2.18 35.02,24.86 v34.92,24.77 | U$6.12 v45.08,24.63 | v6.22,9.53 6.48,9.78 R4.P$2 | U5.14 28.62,15.29 | C6.P$1 v29.84,8.26
  Top 0.254: 28.62,15.29 v28.57,15.24
  Top 0.61: 18.43,5.07 v18.41,5.08 18.42,5.09 C9.P$1 v20.32,5.08 20.4,5.08 IC2.2 | F1.2 v12.32,21.34
  Route15 0.178: v1.91,5.08 2.54,5.71 3.81,5.71 v4.45,5.08 | v32.64,19.05 31.75,19.05 | v34.29,19.05 34.29,19.68 | v43.18,6.35 43.18,5.71 | v45.09,26.92 44.07,26.92 | v55.24,32.38 55.24,33.02 | v34.92,24.77 34.29,24.77 | v34.29,27.3 33.66,27.3 | v28.57,15.24 27.94,15.24 | v29.84,8.26 29.21,8.26
  Route15 0.61: v9.53,1.91 8.89,1.91 | v18.41,5.08 17.14,5.08 | J1.2 30.48,4.45 | v41.91,7.62 41.91,8.26 | v12.32,21.34 12.95,21.34 | v6.22,9.53 5.71,9.53 | v13.59,8.26 12.95,8.26
  Bottom 0.178: SJ1.1 34.75,27.76 v34.29,27.3
  pour Route15: -3.81,41.27 60.33,41.27 60.33,-3.81 -3.81,-3.81
AN1  (via drill 0.25)
  Top 0.178: U2.24 30.22,27.05 v30.48,27.3
  Route2 0.178: v30.48,27.3 v30.48,31.75
  Route15 0.178: v30.48,31.75 v26.67,31.75
  Bottom 0.178: v26.67,31.75 26.67,33.02 26.29,33.4 24.51,33.4 24.13,33.02 24.13,32.13 ANALOG_PINS.P$2
AN2  (via drill 0.25)
  Top 0.178: U2.25 28.84,24.39 v29.21,24.77
  Route2 0.178: v29.21,24.77 v29.21,29.21
  Route15 0.178: v29.21,29.21 v22.23,29.21
  Bottom 0.178: v22.23,29.21 22.23,29.86 22.86,30.48 ANALOG_PINS.P$3
AN3  (via drill 0.25)
  Top 0.178: U2.26 v29.75,23.59
  Route2 0.178: v31.75,23.5 v31.75,28.57
  Route15 0.178: v29.75,23.59 29.84,23.5 v31.75,23.5 | v21.59,28.57 v31.75,28.57
  Bottom 0.178: ANALOG_PINS.P$4 21.59,31.45 v21.59,28.57
CTS  (via drill 0.25)
  Top 0.152: U$6.6 49.53,26.3 v49.53,28.57
  Bottom 0.152: v49.53,28.57 48.9,29.21 48.9,31.61 U$5.4
D2  (via drill 0.25)
  Top 0.178: U2.32 28.32,18.79 27.94,18.41 v26.67,18.41
  Route2 0.178: v26.67,18.41 v26.67,25.4 | v37.47,25.4 v37.47,33.66
  Route15 0.178: v26.67,25.4 v37.47,25.4
  Bottom 0.178: DIGITAL_PINS.P$2 36.83,31.5 36.83,33.02 v37.47,33.66
D4  (via drill 0.25)
  Top 0.178: R6.P$1 v33.02,5.97 | v31.11,15.88 31.02,15.97 U2.2
  Route2 0.178: v33.02,5.97 32.38,6.6 v32.38,15.88
  Route15 0.178: v32.38,15.88 v31.11,15.88
D5_LANC_CMD  (via drill 0.25)
  Top 0.178: U2.9 37.73,18.79 38.1,18.41 v38.1,17.14 | v40.64,5.71 R13.P$1 | v52.07,6.99 R10.P$1
  Route2 0.178: v38.1,17.14 v38.1,5.71 | v43.81,15.88 v43.81,5.71 | v40.64,32.38 v40.64,15.88
  Route15 0.178: v38.1,5.71 v40.64,5.71 | v38.1,17.14 39.37,17.14 v40.64,15.88 v43.81,15.88 | v43.81,5.71 44.45,6.35 51.44,6.35 v52.07,6.99 | v36.2,33.02 40.01,33.02 v40.64,32.38
D6_LANC_ACK  (via drill 0.25)
  Top 0.178: U2.10 38.64,19.59 v38.73,19.5 | v43.18,8.26 OK2.7 | R12.P$2 v38.73,16.51
  Route2 0.178: v43.18,19.68 v43.18,8.26 | v38.73,16.51 v38.73,19.5
  Route15 0.178: v38.73,19.5 42.99,19.5 v43.18,19.68
D7  (via drill 0.25)
  Top 0.178: U2.11 36.12,20.39 v35.56,20.95
  Route2 0.178: v31.11,20.95 v31.11,31.11
  Route15 0.178: v35.56,20.95 v31.11,20.95
  Bottom 0.178: v31.11,31.11 31.75,31.75 34.05,31.75 DIGITAL_PINS.P$4
D8  (via drill 0.25)
  Top 0.178: v39.37,21.59 39.13,21.19 U2.12
  Route2 0.178: v39.37,21.59 v39.37,29.84
  Route15 0.178: v39.37,29.84 v36.2,29.84
  Bottom 0.178: v36.2,29.84 35.57,30.47 DIGITAL_PINS.P$3
D+CAM  (via drill 0.25)
  Top 0.178: v24.13,20.32 23.11,20.32 22.73,19.94 U4.4
  Route2 0.178: v22.23,26.67 22.86,26.67 24.13,25.4 v24.13,20.32
  Route15 0.178: v10.79,26.67 v22.23,26.67
  Bottom 0.178: USB_HOST.D+ 10.79,25.27 v10.79,26.67
D+M34  (via drill 0.25)
  Top 0.178: R5.P$2 v17.78,21.34 | v21.59,20.95 21.72,20.83 U4.2
  Route15 0.178: v17.78,21.34 18.16,20.95 v21.59,20.95
D+PC  (via drill 0.25)
  Top 0.178: USB-PC.D+ v23.5,30.23 | v24.77,22.86 24.77,21.59 24.13,20.95 22.86,20.95 22.23,20.32 U4.3
  Route2 0.178: v23.5,30.23 23.5,29.84 24.77,28.57 v24.77,22.86
D-CAM  (via drill 0.25)
  Top 0.178: v23.5,24.13 23.5,23.42 U4.6
  Route2 0.178: v21.59,26.04 22.86,26.04 23.5,25.4 v23.5,24.13
  Route15 0.178: v8.26,26.67 8.89,26.04 v21.59,26.04
  Bottom 0.178: USB_HOST.D- 8.51,26.41 v8.26,26.67
D-M34  (via drill 0.25)
  Top 0.178: v22.23,21.59 U4.8 | R1.P$2 v19.05,21.59
  Route15 0.178: v19.05,21.59 v22.23,21.59
D-PC  (via drill 0.25)
  Top 0.178: 24.26,29.84 v24.13,29.97 24.13,32.74 USB-PC.D- | v23.5,21.59 23.11,21.59 22.73,21.97 U4.7
  Route2 0.178: v24.13,29.97 25.4,28.7 v25.4,21.59
  Route15 0.178: v25.4,21.59 v23.5,21.59
D_N
  Top 0.152: U$6.9 47.76,26.57 47.85,26.67 47.85,30.23 48.61,30.98 U$12.1
D_P
  Top 0.152: U$12.3 48.35,29.98 48.16,29.78 48.16,26.67 48.26,26.57 U$6.8
DF13-5V  (via drill 0.25)
  Top 0.152: 53.33,31.1 v53.34,31.11
  Top 0.203: D3.3 52.94,28.81 53.34,29.21 53.33,31.1
  Bottom 0.152: 52.7,31.57 U$5.1
  Bottom 0.203: 52.7,31.57 52.88,31.57 v53.34,31.11
DF13_RTS  (via drill 0.25)
  Top 0.152: R15.P$2 v53.98,26.67
  Top 0.178: v47.62,16.51 47.62,16.85 U$10.5
  Route2 0.152: v46.99,27.3 47.62,27.94
  Route2 0.178: v46.99,29.84 47.62,29.21 47.62,27.94 v47.62,16.51
  Route15 0.152: v53.98,26.67 53.34,27.3 v46.99,27.3
  Bottom 0.178: U$5.5 47.66,30.51 v46.99,29.84
DF13_TX  (via drill 0.25)
  Top 0.152: R16.P$2 46.62,18.68 45.97,18.03 U$10.2 44.06,18.03 43.81,17.78 v43.81,17.14
  Route2 0.152: v51.44,17.14 v51.44,29.21
  Route15 0.152: v43.81,17.14 v51.44,17.14
  Bottom 0.152: v51.44,29.21 51.44,31.59 U$5.2
FT231X_RTS  (via drill 0.25)
  Top 0.178: U$6.19 48.76,21.45 49.28,20.95 v49.53,20.95 | U$10.6 48.65,17.53 48.9,17.78 v48.9,18.41
  Route2 0.178: v49.53,20.95 49.53,19.05 v48.9,18.41
FT231X_TX  (via drill 0.25)
  Top 0.152: v43.81,20.32 43.81,19.05 44.34,18.53 U$10.1
  Top 0.178: U$6.17 47.76,21.45 v48.9,20.32
  Route15 0.178: v43.81,20.32 v48.9,20.32
GND  (via drill 0.25)  (1 unrouted)
  Top 0.152: 49.34,29.65 49.34,30.29 49.15,30.48 U$12.2
  Top 0.178: U4.5 23.22,18.06 v23.5,17.78 | U4.9 21.72,24.64 v21.59,24.77 | v50.8,24.13 U$6.3 U$6.21 U$6.13
  Bottom 0.152: U$5.6 46.41,31.16 v46.35,30.48
  other vias: 1.91,14.61 3.17,14.61 4.45,14.61 48.26,13.34 49.53,13.34 50.8,13.34 6.35,6.99 7.62,6.99 8.89,6.99 19.05,31.11 19.05,29.84 19.05,28.57 43.81,31.75 44.45,31.11 29.84,33.66 30.48,33.02 48.26,24.13 54.61,28.57 55.24,27.94
  pour Top: -1.27,38.73 57.78,38.73 57.78,-1.27 -1.27,-1.27
  pour Bottom: -5.08,42.55 61.59,42.55 61.59,-5.08 -5.21,-5.08
GND_LANC  (via drill 0.25)
  Top 0.178: v41.91,10.79 OK2.5 45.72,10.79 48.26,8.26 OK2.2 | LANC.P$1 8.26,31.5 v8.26,36.2 | ZEN(5V).A 40.9,24.39 v41.91,24.39
  Route2 0.178: v41.91,10.79 v41.91,24.39 | v41.91,36.2 v41.91,30.48
  Route15 0.178: v8.26,36.2 v41.91,36.2 | v41.91,30.48 v40.01,30.48
  Bottom 0.152: 39.19,25.08 40.01,24.38
  Bottom 0.178: v40.01,30.48 40.01,28.76 SJ2.2 39.19,25.08 | 40.01,24.38 v41.91,24.39
INT  (via drill 0.25)
  Top 0.178: U2.13 36.43,21.99 v36.2,21.97 | v19.68,15.88 19.68,16.82 U1.18 | R3.P$2 v21.65,9.53
  Route2 0.178: v36.2,21.97 36.2,18.41 v36.83,17.78 | v21.65,9.53 21.65,15.18 20.95,15.88 v19.68,15.88
  Route15 0.178: v36.83,17.78 31.11,17.78 29.84,16.51 20.32,16.51 v19.68,15.88
LANC_LINE  (via drill 0.25)
  Top 0.178: OK2.6 v42.55,9.53 | 41.91,26.67 41.91,26.66 42.53,26.66 v42.55,26.67 | 41.91,26.67 R7.P$1 | LANC.P$2 v9.53,35.56 | R11.P$2 43.18,27.3 v42.55,26.67 | 41.91,26.67 v42.55,26.67 | ZEN(5V).C 41.39,26.15 41.91,26.67
  Route2 0.178: v42.55,9.53 v42.55,26.67 v42.55,35.56
  Route15 0.178: v9.53,35.56 v42.55,35.56
MISO  (via drill 0.25)
  Top 0.178: U1.15 17.8,14.59 v17.78,14.61 | U2.16 v36.2,24.39 v36.2,24.38
  Route2 0.178: v17.78,14.61 v17.78,12.7 v17.78,3.17 | v33.66,24.13 v33.66,19.68 | v27.3,19.68 27.3,13.34 v26.67,12.7
  Route15 0.178: v17.78,3.17 18.41,2.54 31.11,2.54 J1.1 | v36.2,24.38 35.94,24.13 v33.66,24.13 | v33.66,19.68 v27.3,19.68 | v26.67,12.7 v17.78,12.7
MOSI  (via drill 0.25)
  Top 0.178: v28.57,13.34 U5.11 | v38.1,23.5 38.01,23.59 U2.15
  Route2 0.178: v29.21,3.17 28.57,3.81 v28.57,13.34 | v37.47,13.34 37.47,22.86 v38.1,23.5
  Route15 0.178: J1.4 33.02,3.17 v29.21,3.17 | v28.57,13.34 v37.47,13.34
MOSI-IN  (via drill 0.25)
  Top 0.178: U1.16 23.02,15.09 v23.11,14.99 | v26.04,13.34 U5.4
  Route2 0.178: v26.04,14.61 v26.04,13.34
  Route15 0.178: v23.11,14.99 25.65,14.99 v26.04,14.61
N$1
  Top 0.178: OK2.3 51.43,9.53 R10.P$2
N$2
  Top 0.178: Y1.1 33.73,15.55 34.04,15.88 34.54,15.88 35.02,16.35 U2.7
N$3
  Top 0.178: Y1.3 36.12,16.99 U2.8
N$4
  Top 0.178: R2.P$2 LED1.A
N$5  (via drill 0.25)
  Top 0.178: U1.25 13.94,15.09 v13.72,14.86 13.72,15.75 13.08,16.38 C4.P$2 | v13.72,10.54 13.39,10.21 Q1.1
  Route2 0.178: v13.72,14.86 v13.72,10.54
N$6
  Top 0.178: U1.21 18.16,18.29 R5.P$1
N$7
  Top 0.178: U1.20 18.66,18.29 R1.P$1
N$8  (via drill 0.25)
  Top 0.178: Q1.3 10.79,14.67 v10.79,15.24 | v10.79,18.41 C3.P$2 | U1.24 16.66,16.86 16.64,17.4 16.38,17.65 v15.88,17.65
  Route2 0.178: v10.79,15.24 v10.79,18.41
  Route15 0.178: v15.88,17.65 11.56,17.65 v10.79,18.41
N$9  (via drill 0.25)
  Top 0.178: 20.95,6.83 IC2.1
  Top 0.406: R9.P$1 R8.P$2 v15.88,7.62
  Top 0.61: v20.32,7.62 20.95,6.83
  Route15 0.406: v15.88,7.62 v20.32,7.62
N$10  (via drill 0.25)
  Top 0.178: v43.18,29.21 43.19,28.59 R11.P$1
  Top 0.203: OK2.1 v45.72,6.99
  Route2 0.178: v45.72,6.99 44.45,8.26 44.45,27.94 v43.18,29.21
N$12
  Top 0.178: R6.P$2 LED3.A
N$13  (via drill 0.25)
  Top 0.178: v41.91,29.21 R7.P$2
  Route15 0.178: v33.66,28.57 41.27,28.57 v41.91,29.21
  Bottom 0.178: SJ1.2 35.56,28.83 35.31,29.08 34.04,29.08 v33.66,28.57
N$14
  Top 0.203: D3.1 54.86,29.46 55.24,29.84 L2.P$1
N$15
  Top 0.178: R13.P$2 LED4.A
N$19
  Top 0.152: U$12.6 50.2,32.73 USB1.D-
N$20
  Top 0.152: U$12.4 49.78,29.98 49.66,30.1 49.66,31.24 49.53,31.37 USB1.D+
N$21  (via drill 0.25)
  Top 0.152: U$6.20 49.52,22.23 v50.16,21.59 LED5.A | U$6.11 46.36,25.41 46.99,26.04 U$6.10
  Top 0.178: LED5.A LED6.A 53.32,19.8 C12.P$1 | U$6.11 45.99,25.13 v45.72,25.4
  Route2 0.178: v45.72,25.4 v45.72,21.59
  Route15 0.178: v45.72,21.59 v50.16,21.59
N$22
  Top 0.178: U$6.14 45.35,23.63 R17.P$1
N$23  (via drill 0.25)
  Top 0.152: R18.P$1 53.2,16.51 v52.07,16.51 | U$6.7 48.76,27.8 v48.9,27.94
  Route2 0.152: v52.07,16.51 v52.07,27.94
  Route15 0.152: v52.07,27.94 v48.9,27.94
N$24  (via drill 0.25)
  Top 0.178: LED5.C v50.16,16.51 | v45.09,20.95 R17.P$2
  Route2 0.178: v45.09,15.88 v45.09,20.95
  Route15 0.178: v50.16,16.51 49.53,15.88 v45.09,15.88
N$25
  Top 0.178: LED2.A R14.P$2
N$26
  Top 0.178: LED6.C 53.32,18.3 R18.P$2
N$27  (via drill 0.25)
  Top 0.61: D1.A v45.09,1.91
  Route15 0.61: v45.09,1.91 RAW.2
N$28  (via drill 0.25)
  Top 0.178: R20.P$2 17.28,24 v17.14,24.13 | v26.04,24.77 25.4,25.4 D2.C
  Route15 0.178: v17.14,24.13 22.23,24.13 22.86,24.77 v26.04,24.77
PC_SEL
  Top 0.178: R20.P$1 R19.P$2 19.05,22.86 20.32,21.59 20.32,19.68 U4.1
RESET  (via drill 0.25)
  Top 0.178: v29.72,21.21 29.57,21.19 U2.29 | J1.5 v38.73,1.91 | v29.21,12.7 30.21,12.7 U5.10 | v6.22,17.14 5.71,16.64 | v6.22,12.06 6.22,11.57 R4.P$1 7.72,11.42 C14.P$2
  Top 0.406: S2.4 5.71,16.64 S2.3
  Route2 0.178: v29.72,21.21 29.21,20.7 v29.21,17.14 v29.21,12.7 | v38.73,1.91 38.73,12.06 v39.37,12.7 | v6.22,17.14 v6.22,12.06
  Route15 0.178: v6.22,17.14 v29.21,17.14 | v39.37,12.7 v29.21,12.7
RESET-IN
  Top 0.178: U1.12 23.11,13.09 23.5,12.7 24.37,12.7 U5.5
RTS#  (via drill 0.25)
  Top 0.152: U$10.3 45.34,17.53 v46.35,16.51
  Top 0.178: C14.P$1 7.87,10.18 v8.89,10.18
  Route2 0.152: v46.35,16.51 v46.35,12.06
  Route2 0.178: v8.89,10.18 v8.89,12.06
  Route15 0.178: v46.35,12.06 v8.89,12.06
RXD  (via drill 0.25)
  Top 0.152: U2.31 31.02,19.59 v31.75,20.32 | v50.8,22.86 50.53,23.13 U$6.1
  Route2 0.152: v43.18,20.95 v43.18,22.86 v43.18,26.04
  Route15 0.152: v43.18,22.86 v50.8,22.86 | v43.18,26.04 49.53,26.04 v50.16,26.67
  Route15 0.178: v31.75,20.32 42.55,20.32 v43.18,20.95
  Bottom 0.152: v50.16,26.67 50.8,27.3 50.8,29.84 50.16,30.48 U$5.3
SCK  (via drill 0.25)
  Top 0.178: J1.3 35.56,3.17 R2.P$1 35.55,7.62 34.92,7.62 v34.29,8.26 | U5.13 31.11,14.63 v31.11,14.61 | U2.17 36.2,26.26 v36.2,26.67
  Route2 0.178: v31.11,14.61 v31.11,8.26 | v36.2,26.67 35.56,26.04 35.56,23.5 34.92,22.86 34.92,16.51 v35.56,15.88
  Route15 0.178: v31.11,8.26 v34.29,8.26 | v35.56,15.88 35.56,15.24 34.92,14.61 v31.11,14.61
SCK-IN
  Top 0.178: U1.13 22.86,13.59 23.91,14.63 U5.2
SCL  (via drill 0.25)
  Top 0.178: U2.28 v29.74,21.99 | I2C.P$2 35.57,30.49 v34.92,29.84
  Route2 0.178: v33.02,22.23 v33.02,29.84
  Route15 0.178: v29.74,21.99 29.97,22.23 v33.02,22.23 | v34.92,29.84 v33.02,29.84
SDA  (via drill 0.25)
  Top 0.178: U2.27 v29.77,22.79 | I2C.P$3 36.82,30.49 36.83,30.48 v36.83,29.21
  Route2 0.178: v32.38,22.86 v32.38,29.21
  Route15 0.178: v29.77,22.79 29.84,22.86 v32.38,22.86 | v36.83,29.21 v32.38,29.21
SS  (via drill 0.25)
  Top 0.178: U5.12 30.21,13.97 v27.94,13.97 | v36.2,22.86 36.27,22.79 U2.14
  Route2 0.178: v40.01,13.97 v40.01,22.86
  Route15 0.178: v27.94,13.97 v40.01,13.97 | v40.01,22.86 v36.2,22.86
SS-IN  (via drill 0.25)
  Top 0.178: U1.14 19.8,14.09 v19.68,13.97 | v25.4,13.97 24.4,13.97 arc-90 U5.3
  Route15 0.178: v19.68,13.97 v25.4,13.97
TXD  (via drill 0.25)
  Top 0.152: U$10.7 47.24,18.03 v46.99,17.78 | v30.48,20.32 28.8,20.32 U2.30
  Route2 0.152: v30.48,19.05 v30.48,20.32
  Route15 0.152: v46.99,17.78 46.35,18.41 31.11,18.41 v30.48,19.05
V+_LANC(5-9V)  (via drill 0.25)
  Top 0.178: LANC.P$3 10.79,31.5 v10.79,34.29
  Route2 0.178: v38.1,34.92 v38.1,26.67
  Route15 0.178: v10.79,34.29 11.43,34.92 v38.1,34.92
  Bottom 0.178: v38.1,26.67 37.47,26.67 36.37,27.76 | 36.2,27.94 36.37,27.76 | 36.37,27.76 SJ1.3
VBUS_CAM  (via drill 0.25)
  Top 0.178: v22.23,25.4 22.68,25.86 D4.C
  Top 0.61: F1.1 v8,22.23
  Route15 0.178: v6.35,26.67 7.62,25.4 v22.23,25.4
  Bottom 0.178: USB_HOST.VBUS 6.35,25.32
  Bottom 0.406: 6.35,25.32 v6.35,26.67
  Bottom 0.61: v8,22.23 6.99,22.23 6.03,23.57 USB_HOST.VBUS
VBUS_FTDIN
  Top 0.152: 50.8,32.73 USB1.VBUS
  Top 0.203: U$12.5 51.18,30.48 51.44,30.73 | 51.44,30.73 51.44,31.5 50.8,32.13 50.8,32.73 | D3.2 52.05,30.11 51.44,30.73
VBUS_PCIN
  Top 0.178: D4.A D2.A 25.4,30.48 24.8,31.09 USB-PC.VBUS
VRAW  (via drill 0.25)
  Top 0.178: 20.79,1.89 IC2.3
  Top 0.61: D1.C 40.01,2.54 v39.37,3.17 | v24.13,3.17 23.09,2.13 IC2.3 | 20.79,1.89 19.07,1.89 C8.P$1 C7.A
  Route2 0.61: v39.37,3.17 v39.37,6.99 | v24.13,6.99 v24.13,3.17
  Route15 0.61: v39.37,6.99 v24.13,6.99

### Text on the board
bNames: GND | VIN